# EAGLE design PCB Arduino1 (EAGLE 7.6.0)
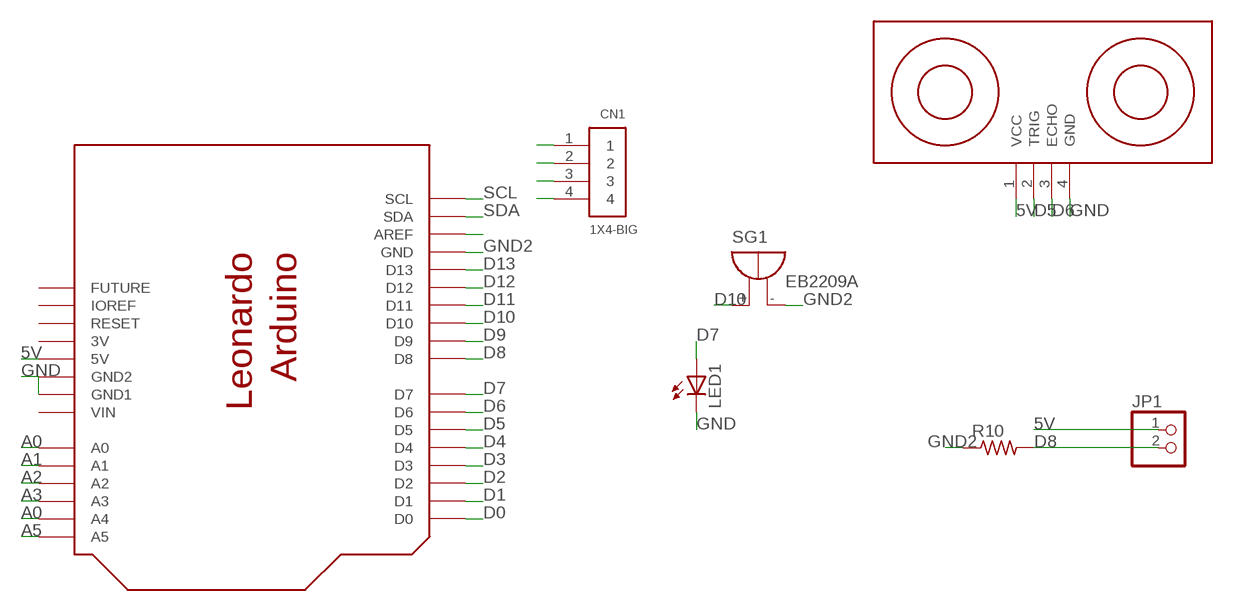
[diagram p0: schematic, sheet 1]

## Parts
CN1  1X4-BIG  [1X04-BIG]
JP1  PINHD-1X2  [1X02]
LED1  LEDB152  [Q62902-B152]
R10  R-US_0204/7  [0204/7]
SG1  EB2209A  [EB2209A]
U$1  ARDUINO_LEONARDO  [ARDUINO_LEONARDO]
U$2  ULTRASONIC-HC-SR04  [ULTRASONIC-HC-SR04]

## Nets
5V: CN1.1 JP1.1 U$1.5V U$2.1(VCC)
A0: U$1.A0
A1: U$1.A1
A2: U$1.A2
A3: U$1.A3
A4: U$1.A4
A5: U$1.A5
D0: U$1.D0
D1: U$1.D1
D2: U$1.D2
D3: U$1.D3
D4: U$1.D4
D5: U$1.D5 U$2.2(TRIG)
D6: U$1.D6 U$2.3(ECHO)
D7: LED1.A U$1.D7
D8: JP1.2 R10.2 U$1.D8
D9: U$1.D9
D10: SG1.+ U$1.D10
D11: U$1.D11
D12: U$1.D12
D13: U$1.D13
GND: CN1.2 LED1.K(C) U$1.GND$2(GND2) U$1.GND$3(GND1) U$2.4(GND)
GND2: R10.1 SG1.- U$1.GND
N$3: U$1.AREF
SCL: CN1.4 U$1.SCL
SDA: CN1.3 U$1.SDA
Unconnected: U$1.IOREF U$1.RESERVED(FUTURE) U$1.RESET

## Power pins joined to a net without a drawn wire
3V: U$1.3V
VIN: U$1.VIN

## Library data of the parts
CN1 = adafruit:1X4: 4-pin connector
JP1 = pinhead:PINHD-1X2: PIN HEADER
LED1 = adafruit:LED: LED OSRAM: - CHIPLED LG R971, LG N971, LY N971, LG Q971, LY Q971, LO R971, LY R971 LH N974, LH R974 LS Q976, LO Q976, LY Q976 LO Q996 - Hyper CHIPLED LW Q18S LB Q993, LB Q99A, LB R99A - SideLED LS A670, LO A670, LY A670, LG A670, LP A670 LB A673, LV A673, LT A673, LW A673 LH A674 LY A675 LS A676, LA A676, LO A676, LY A676, LW A676 LS A679, LY A679, LG A679 - Hyper Micro SIDELED® LS Y876, LA Y876, LO Y876, LY Y876 LT Y87S - SmartLED LW L88C, LW L88S LB L89C, LB L89S, LG L890 LS L89K, LO L89K, LY L89K LS L896, LA L896, LO L896, LY L896 - TOPLED LS T670, LO T670, LY T670, LG T670, LP T670 LSG T670, LSP T670, LSY T670, LOP T670, LYG T670 LG T671, LOG T671, LSG T671 LB T673, LV T673, LT T673, LW T673 LH T674 LS T676, LA T676, LO T676, LY T676, LB T676, LH T676, LSB T676, LW T676 LB T67C, LV T67C, LT T67C, LS T67K, LO T67K, LY T67K, LW E67C LS E67B, LA E67B, LO E67B, LY E67B, LB E67C, LV E67C, LT E67C LW T67C LS T679, LY T679, LG T679 LS T770, LO T770, LY T770, LG T770, LP T770 LB T773, LV T773, LT T773, LW T773 LH T774 LS E675, LA E675, LY E675, LS T675 LS T776, LA T776, LO T776, LY T776, LB T776 LHGB T686 LT T68C, LB T68C - Hyper Mini TOPLED® LB M676 - Mini TOPLED Santana® LG M470 LS M47K, LO M47K, LY M47K Source: http://www.osram.convergy.de/
R10 = resistor:R-US_: RESISTOR, American symbol
SG1 = buzzer:EB2209A: BUZZER Source: Buerklin; OC_FARNELL: unknown; OC_NEWARK: unknown
U$1 = srg:ARDUINO_LEONARDO: Arduino Leonardo I2C Pins: D2, D3 PWM Pins: D3, D5, D5, D11, D13 Interrup Pint: D2, D3 http://arduino.cc/en/Main/arduinoBoardLeonardo
U$2 = diy-modules:ULTRASONIC-HC-SR04: Ultrasonic Ranging Module HC-SR04

## Board
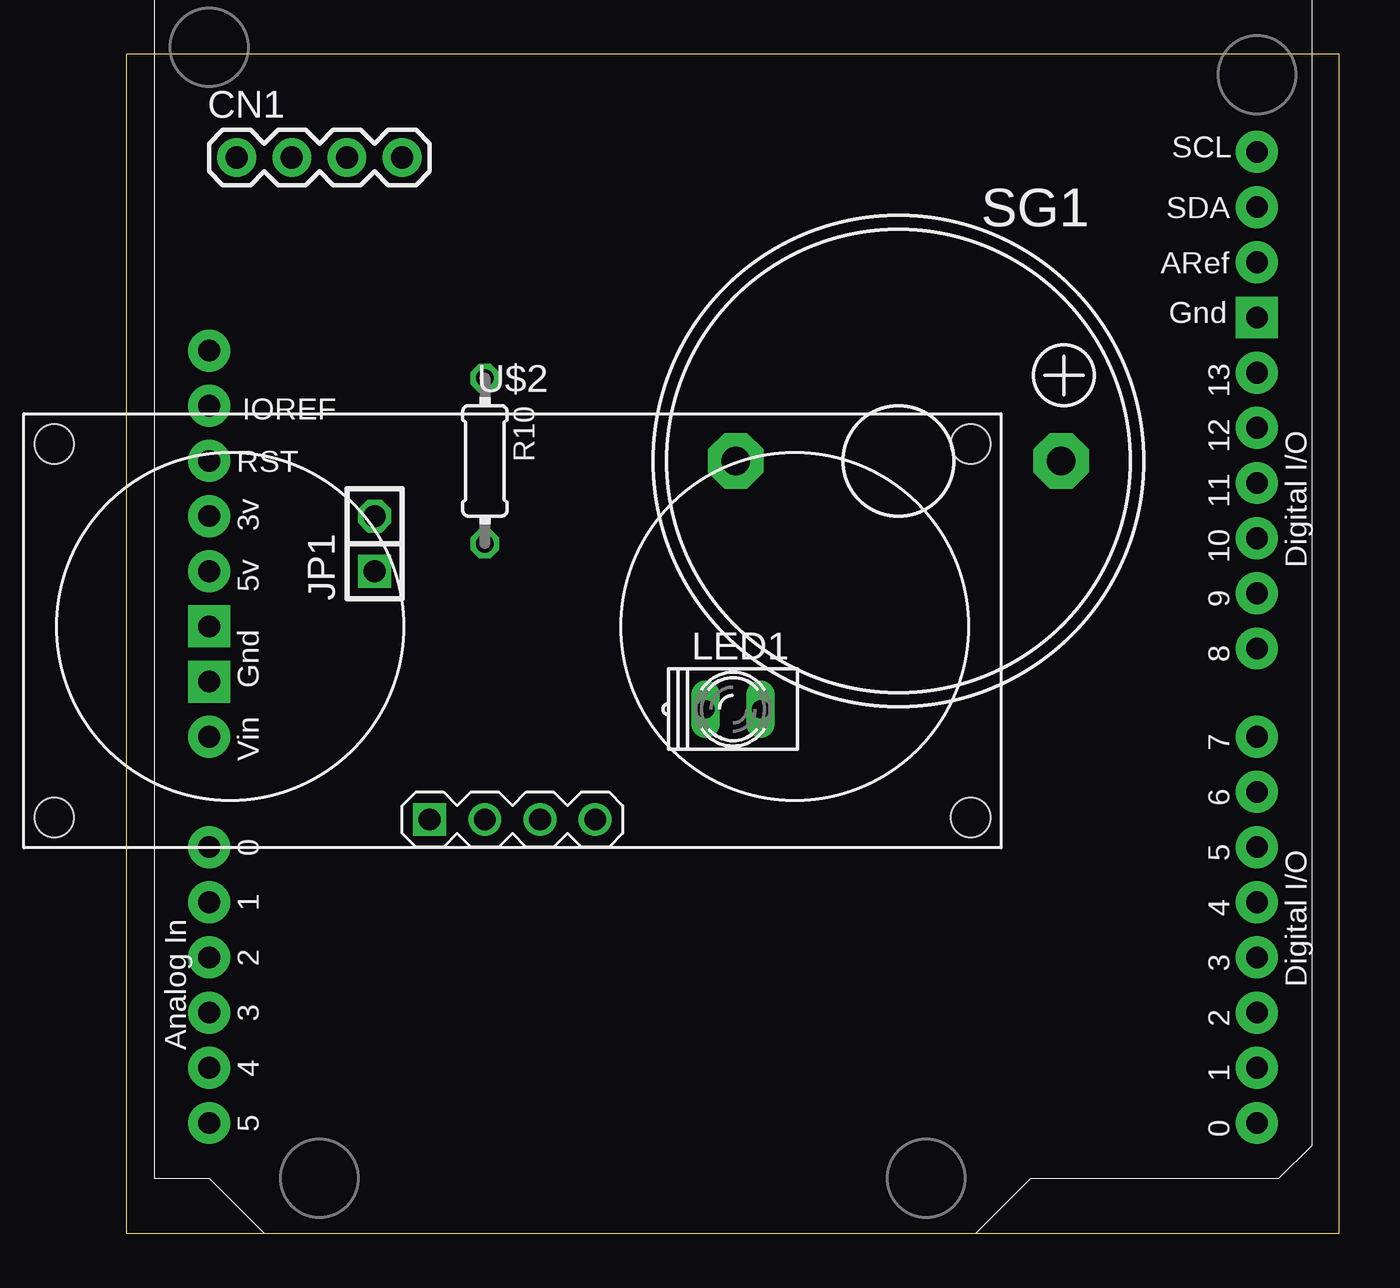
[diagram p1: board, top side]
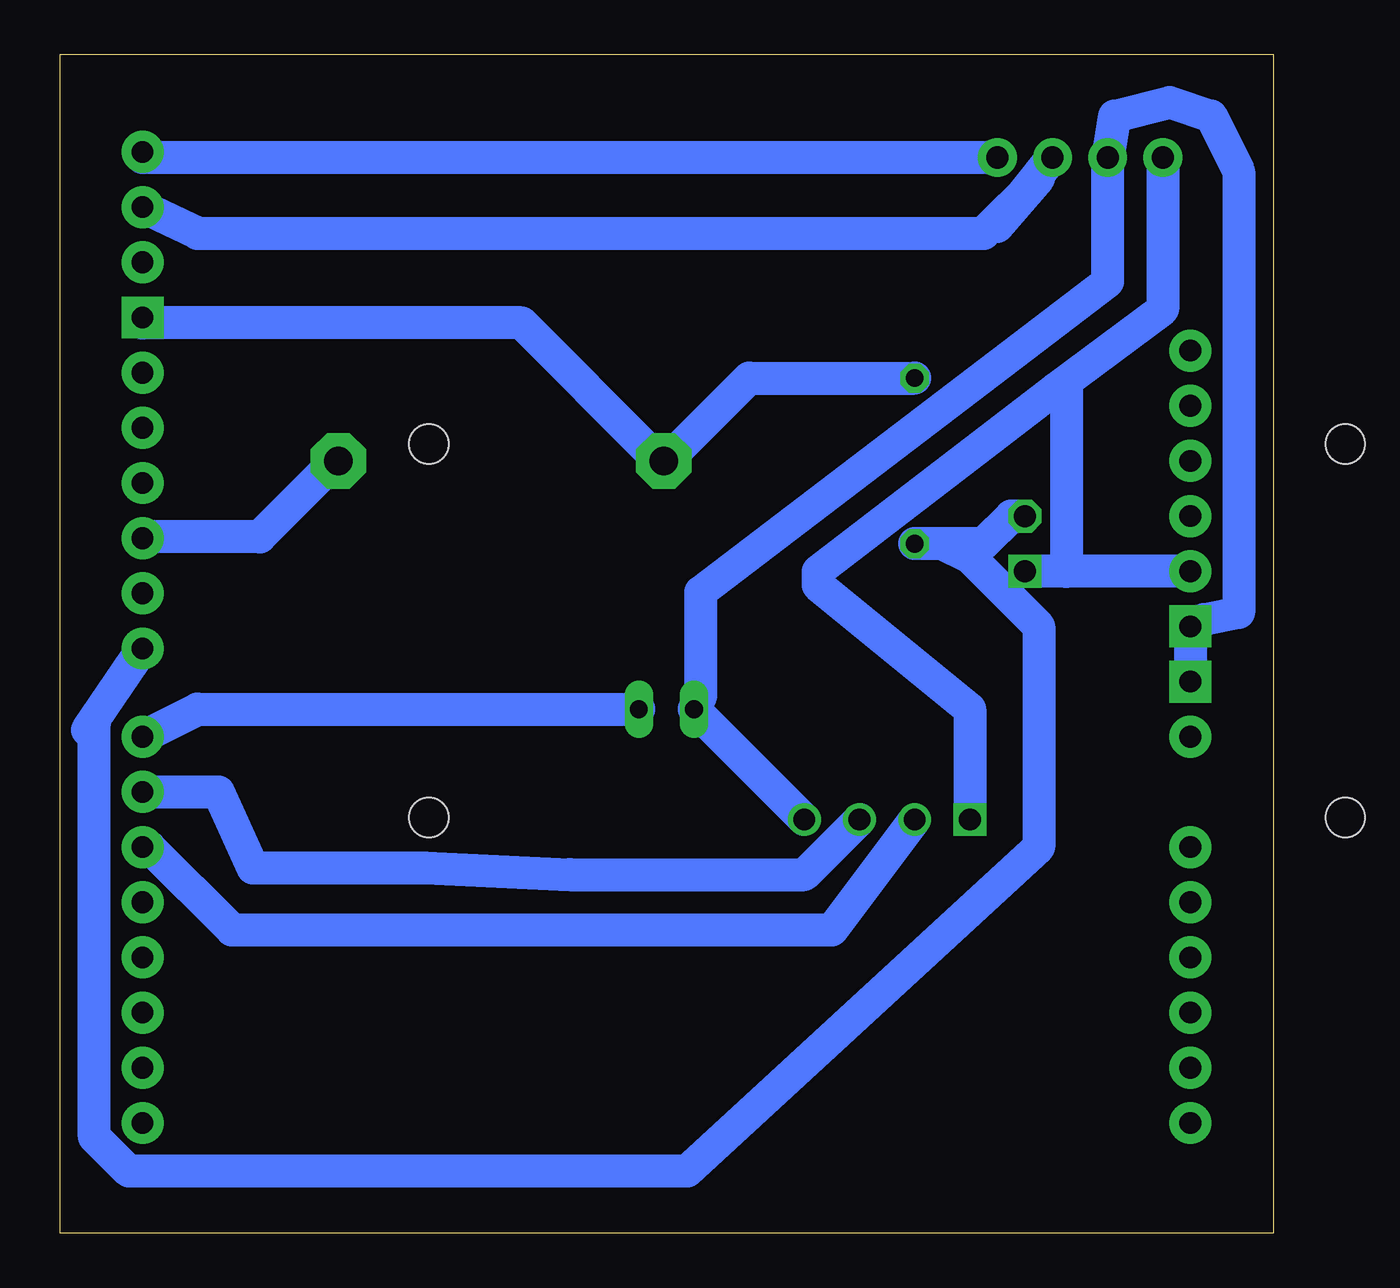
[diagram p2: board, bottom side, seen from below]

Size 55.86 x 54.28 mm. Coordinates in mm from the lower left corner, seen from the top.
Outline: 0,0 55.86,0 55.86,54.28 0,54.28 0,0
Copper layers (1*16): Top 0.035mm / dielectric 1.5mm / Bottom 0.035mm
Design rules "default *": minimum track width 60mil, minimum drill 24mil, track to track 8mil, track to pad 8mil, pad to pad 8mil, via to via 8mil, smd to smd 8mil, copper to edge 40mil, drill to drill 8mil, minimum pad ring 10mil, minimum via ring 8mil, stop-mask expansion 4mil, vias tented up to drill 0mil, thermal gap 10mil

### Footprints (pad centres in the part's own frame; a part is rotated, then mirrored left to right if it is on the bottom)
1X04-BIG = drill 1.016 pad 1.778: 1 0,0; 2 2.54,0; 3 5.08,0; 4 7.62,0
1X02 = drill 1.016 square: 1 -1.27,0 | drill 1.016 octagon: 2 1.27,0
Q62902-B152 = drill 0.813 long: A 1.27,0; K -1.27,0
0204/7 = drill 0.813 octagon: 1 -3.81,0; 2 3.81,0
EB2209A = drill 1.321 pad 2.54 octagon: + 7.493,0; - -7.493,0
ARDUINO_LEONARDO = drill 1 pad 1.93: 3V 1.27,-24.13; 5V 3.81,-24.13; A0 16.51,-24.13; A1 19.05,-24.13; A2 21.59,-24.13; A3 24.13,-24.13; A4 26.67,-24.13; A5 29.21,-24.13; AREF -10.414,24.13; D0 29.21,24.13; D1 26.67,24.13; D2 24.13,24.13; D3 21.59,24.13; D4 19.05,24.13; D5 16.51,24.13; D6 13.97,24.13; D7 11.43,24.13; D8 7.366,24.13; D9 4.826,24.13; D10 2.286,24.13; D11 -0.254,24.13; D12 -2.794,24.13; D13 -5.334,24.13; IOREF -3.81,-24.13; RESERVED -6.35,-24.13; RESET -1.27,-24.13; SCL -15.494,24.13; SDA -12.954,24.13; VIN 11.43,-24.13 | drill 1 pad 1.93 square: GND -7.874,24.13; GND$2 8.89,-24.13; GND$3 6.35,-24.13
ULTRASONIC-HC-SR04 = drill 1 square: 1 -3.81,-8.89 | drill 1: 2 -1.27,-8.89; 3 1.27,-8.89; 4 3.81,-8.89 | hole 1.8: -21.1,8.4; -21.1,-8.8; 21.1,-8.8; 21.1,8.4

### Placement (x,y rotation side)
CN1  5.08,49.53 0 top
JP1  11.43,31.75 90 top
LED1  27.94,24.13 0 top
R10  16.51,35.56 270 top
SG1  35.56,35.56 0 top
U$1  27.94,34.29 270 top
U$2  17.78,27.94 0 top

### Tracks (layer width: path | path; a pad name or v marks a point on that pad's centre or on a via)
5V
  Bottom 1.524: U$1.5V 9.53,30.48 | 9.53,30.48 JP1.1 | U$2.1 13.97,24.13 20.95,29.84 20.95,30.48 10,38.89 | 10,38.89 5.08,42.54 CN1.1 | 9.53,30.48 9.53,39.05 10,38.89
D5
  Bottom 1.524: U$2.2 20.32,13.97 47.94,13.97 51.75,17.78 U$1.D5
D6
  Bottom 1.524: U$2.3 21.59,16.51 32.38,16.51 39.05,16.83 46.99,16.83 48.58,20.32 U$1.D6
D7
  Bottom 1.524: LED1.A 49.53,24.13 U$1.D7
D8
  Bottom 1.524: 15.24,31.75 13.33,31.75 12.06,33.02 JP1.2 | 15.24,31.75 R10.2 | U$1.D8 54.61,23.18 54.29,23.49 54.29,4.44 52.7,2.86 26.99,2.86 10.79,17.78 10.79,27.94 13.97,31.11 15.24,31.75
D10
  Bottom 1.524: U$1.D10 52.07,32.07 46.67,32.07 43.18,35.56 SG1.+
GND
  Bottom 1.524: U$1.GND$2 U$1.GND$3 3.17,28.26 1.59,28.57 1.59,48.9 2.86,51.43 4.76,52.07 7.3,51.43 CN1.2 7.62,43.81 26.35,29.53 26.35,24.77 LED1.K U$2.4
GND2
  Bottom 1.524: R10.1 24.13,39.37 27.94,35.56 SG1.- 28.58,35.88 34.61,41.91 52.07,41.91 U$1.GND
SCL
  Bottom 1.524: CN1.4 52.07,49.53 U$1.SCL
SDA
  Bottom 1.524: CN1.3 12.7,46.35 10.79,48.58 13.33,46.04 49.53,46.04 U$1.SDA